# EAGLE schematic exp 4 (EAGLE 9.6.2)
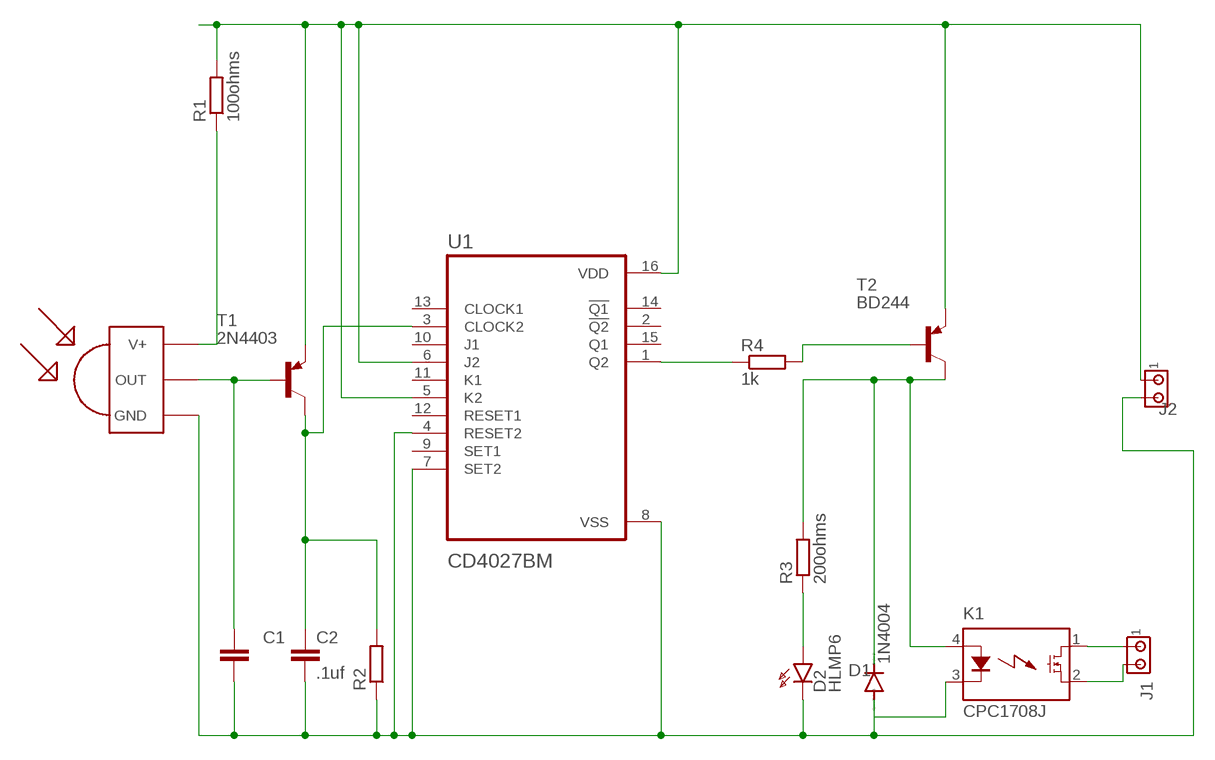
[diagram p0: schematic, sheet 1]

## Parts
C1  C-EU025-030X050  [C025-030X050]
C2  .1uf  C-EU025-030X050  [C025-030X050]
D1  1N4004  [DO41-10]
D2  HLMP6  [HLMP6]
J1  MTA02-156  [1X2MTA]
J2  MTA02-156  [1X2MTA]
K1  CPC1708J  [I4-PAC]
R1  100ohms  R-EU_0204/5  [0204/5]
R2  R-EU_0204/5  [0204/5]
R3  200ohms  R-EU_0204/5  [0204/5]
R4  1k  R-EU_0204/5  [0204/5]
T1  2N4403  BD244  [TO220]
T2  BD244  [TO220]
U1  CD4027BM  [SOIC127P600X175-16N]
U$1  TSOP1738  [TSOP17XX]

## Nets
N$1: C1.2 C2.2 D1.A D2.K J2.2 K1.3(K) R2.1 U1.4(RESET2) U1.7(SET2) U1.8(VSS) U$1.GND
N$2: J2.1 R1.2 T1.3(E) T2.3(E) U1.5(K2) U1.6(J2) U1.16(VDD)
N$3: R1.1 U$1.V+
N$4: C1.1 T1.1(B) U$1.OUT
N$5: C2.1 R2.2 T1.2(C) U1.3(CLOCK2)
N$7: R4.1 U1.1(Q2)
N$8: R4.2 T2.1(B)
N$10: D1.C K1.4(A) R3.2 T2.2(C)
N$11: D2.A R3.1
N$12: J1.1 K1.1(DS1)
N$13: J1.2 K1.2(DS2)
Unconnected: U1.2(!Q2) U1.9(SET1) U1.10(J1) U1.11(K1) U1.12(RESET1) U1.13(CLOCK1) U1.14(!Q1) U1.15(Q1)

## Library data of the parts
C1 C2 = rcl:C-EU: CAPACITOR, European symbol; SPICEPREFIX: C
D1 = diode:1N4004: DIODE general purpose rectifier, 1 A
D2 = display-hp:HLMP6: LED 2mm horizontal; MF: AGILENT TECHNOLOGIES; MPN: HLMP-6500; OC_FARNELL: 1652490; OC_NEWARK: 40K0088
J1 J2 = con-amp:MTA02-156: AMP connector
K1 = relay:CPC1708J: Single-Pole, Normally Open i4-PAC (TM) DC Power Relay Source: Data sheet <http://www.clare.com/home/pdfs.nsf/www/CPC1708.pdf/$file/CPC1708.pdf>
R1-R4 = rcl:R-EU_: RESISTOR, European symbol; SPICEPREFIX: R
T1 T2 = transistor:BD244: PNP TRANSISTOR Source: Motorola Semiconductor, Master Selection Guide Q3/95 SG73 REV 8 page 5.5-5
U1 = CD4027BM (1):CD4027BM: Check availability <https://pricing.snapeda.com/parts/CD4027BM/Texas%20Instruments/view-part?ref=eda>; AVAILABILITY: In Stock; CHECK_PRICES: https://www.snapeda.com/parts/CD4027BM/Texas+Instruments/view-part/?ref=eda; DESCRIPTION: CMOS Dual J-K Master-Slave Flip-Flop; MF: Texas Instruments; MP: CD4027BM; PACKAGE: SOIC-16 Texas Instruments; PRICE: None; SNAPEDA_LINK: https://www.snapeda.com/parts/CD4027BM/Texas+Instruments/view-part/?ref=snap
U$1 = TSOP1738:TSOP1738: Check availability <https://pricing.snapeda.com/parts/TSOP1738./Vishay/view-part?ref=eda>; AVAILABILITY: In Stock; CHECK_PRICES: https://www.snapeda.com/parts/TSOP1738./Vishay/view-part/?ref=eda; DESCRIPTION: IR Remote Receiver 38KHz 35m 3-Pin; MF: Vishay; MP: TSOP1738.; PACKAGE: DIP-3 Vishay; PRICE: None; SNAPEDA_LINK: https://www.snapeda.com/parts/TSOP1738./Vishay/view-part/?ref=snap